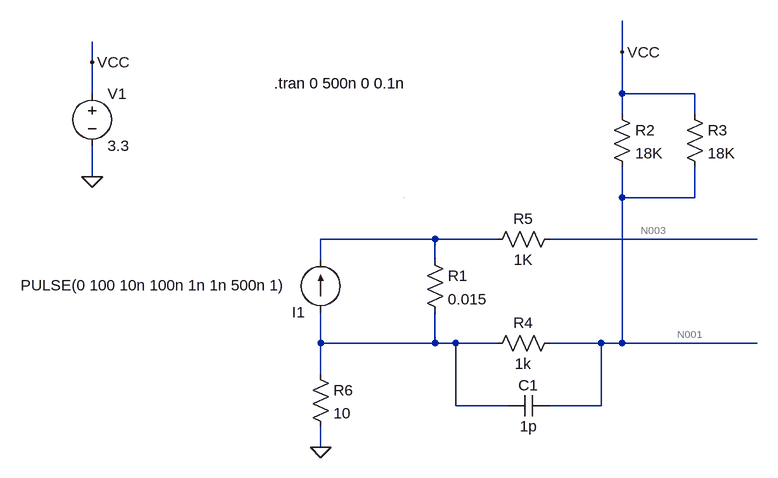
[diagram p0: schematic Iprot.asc]
Iprot.asc, the LTspice schematic file:
Version 4
SHEET 1 1376 680
WIRE 336 -224 336 -272
WIRE -480 -208 -480 -240
WIRE -480 -160 -480 -208
WIRE 336 -160 336 -224
WIRE 448 -160 336 -160
WIRE 336 -128 336 -160
WIRE 448 -128 448 -160
WIRE -480 -32 -480 -80
WIRE 336 0 336 -48
WIRE 448 0 448 -48
WIRE 448 0 336 0
WIRE 48 64 -128 64
WIRE 144 64 48 64
WIRE 544 64 224 64
WIRE -128 96 -128 64
WIRE 48 96 48 64
WIRE -128 224 -128 176
WIRE 48 224 48 176
WIRE 48 224 -128 224
WIRE 80 224 48 224
WIRE 144 224 80 224
WIRE 304 224 224 224
WIRE 336 224 336 0
WIRE 336 224 304 224
WIRE 544 224 336 224
WIRE -128 272 -128 224
WIRE 80 320 80 224
WIRE 160 320 80 320
WIRE 304 320 304 224
WIRE 304 320 224 320
WIRE -128 384 -128 352
WIRE 0 0 0 0
FLAG -128 384 0
FLAG -480 -32 0
FLAG -480 -208 VCC
FLAG 336 -224 VCC
SYMBOL res 32 80 R0
SYMATTR InstName R1
SYMATTR Value 0.015
SYMBOL res 320 -144 R0
SYMATTR InstName R2
SYMATTR Value 18K
SYMBOL res 128 80 R270
WINDOW 0 32 56 VTop 0
WINDOW 3 0 56 VBottom 0
SYMATTR InstName R5
SYMATTR Value 1K
SYMBOL cap 224 304 R90
WINDOW 0 0 32 VBottom 0
WINDOW 3 32 32 VTop 0
SYMATTR InstName C1
SYMATTR Value 1p
SYMBOL current -128 176 R180
WINDOW 3 50 41 Left 0
WINDOW 123 0 0 Left 0
WINDOW 39 0 0 Left 0
SYMATTR Value PULSE(0 100 10n 100n 1n 1n 500n 1)
SYMATTR InstName I1
SYMBOL voltage -480 -176 R0
WINDOW 123 0 0 Left 0
WINDOW 39 0 0 Left 0
SYMATTR InstName V1
SYMATTR Value 3.3
SYMBOL res 432 -144 R0
SYMATTR InstName R3
SYMATTR Value 18K
SYMBOL res 240 208 R90
WINDOW 0 0 56 VBottom 0
WINDOW 3 32 56 VTop 0
SYMATTR InstName R4
SYMATTR Value 1k
SYMBOL res -144 256 R0
SYMATTR InstName R6
SYMATTR Value 10
TEXT -200 -176 Left 0 !.tran 0 500n 0 0.1n

The netlist it stands for:
* Iprot.asc
R1 N002 N004 0.015
R2 VCC N001 18K
R5 N002 N003 1K
C1 N001 N004 1p
I1 N004 N002 PULSE(0 100 10n 100n 1n 1n 500n 1)
V1 VCC 0 3.3
R3 VCC N001 18K
R4 N001 N004 1k
R6 N004 0 10
.tran 0 500n 0 0.1n
.backanno
.end

* Results of the author's LTspice run, read from the files saved beside the schematic
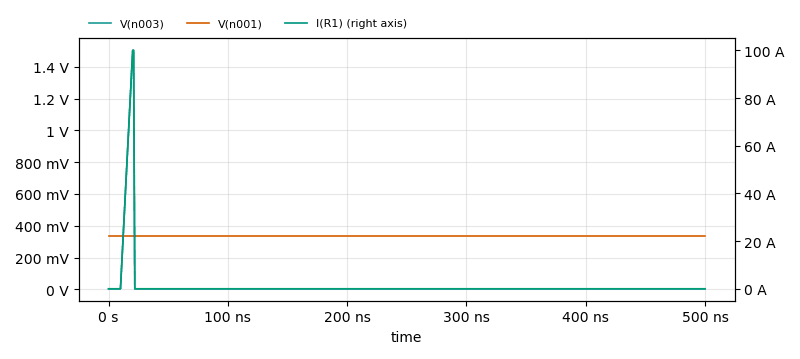
[diagram p1: Transient Analysis of Iprot.asc, plotted from the saved traces]
* Transient Analysis, 1 run:
*   V(n003): min 3.297 mV, max 1.503 V, average 22.44 mV, rms 169.8 mV, last 3.297 mV
*   V(n001): min 333 mV, max 333 mV, average 333 mV, rms 333 mV, last 333 mV
*   I(R1): min 0 A, max 100 A, average 1.276 A, rms 11.3 A, last 0 A